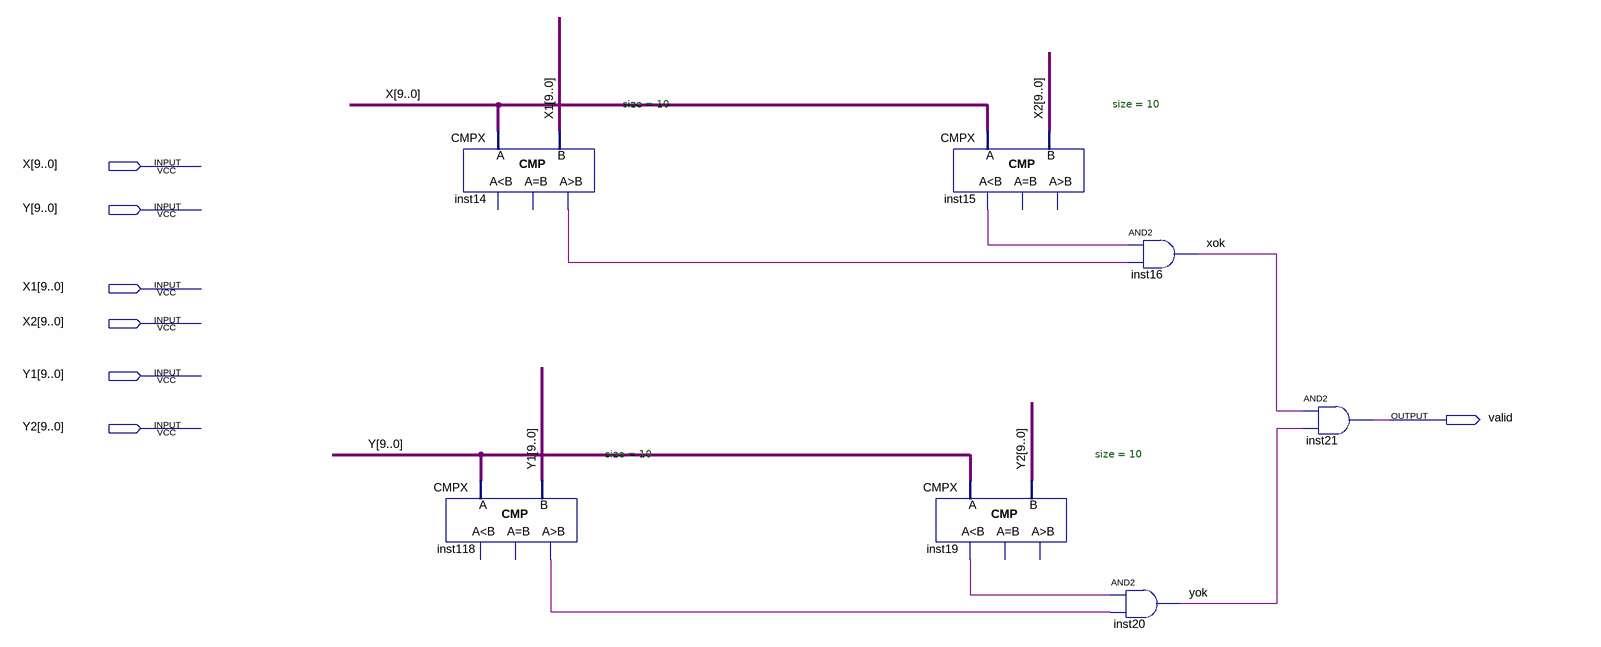
[diagram p0: schematic sheet]
// Quartus schematic MaliKvadratic.bdf as structural Verilog: 7 symbols, 7 pins
module MaliKvadratic (
  input  [9:0] X,
  input  [9:0] Y,
  input  [9:0] X1,
  input  [9:0] X2,
  input  [9:0] Y1,
  input  [9:0] Y2,
  output valid
);

  wire inst14_gr, inst15_ls, inst19_ls, inst118_gr, xok, yok;

  CMPX #(.size(10)) inst14 (.A(X), .B(X1), .gr(inst14_gr));  // open: ls, eq
  CMPX #(.size(10)) inst118 (.A(Y), .B(Y1), .gr(inst118_gr));  // open: ls, eq
  CMPX #(.size(10)) inst15 (.A(X), .B(X2), .ls(inst15_ls));  // open: eq, gr
  CMPX #(.size(10)) inst19 (.A(Y), .B(Y2), .ls(inst19_ls));  // open: eq, gr
  and inst16 (xok, inst15_ls, inst14_gr);
  and inst20 (yok, inst19_ls, inst118_gr);
  and inst21 (valid, xok, yok);
endmodule
